# Altium schematic sheet Analog_output.SchDoc
size A; SheetNumber: 6; SheetTotal: 6
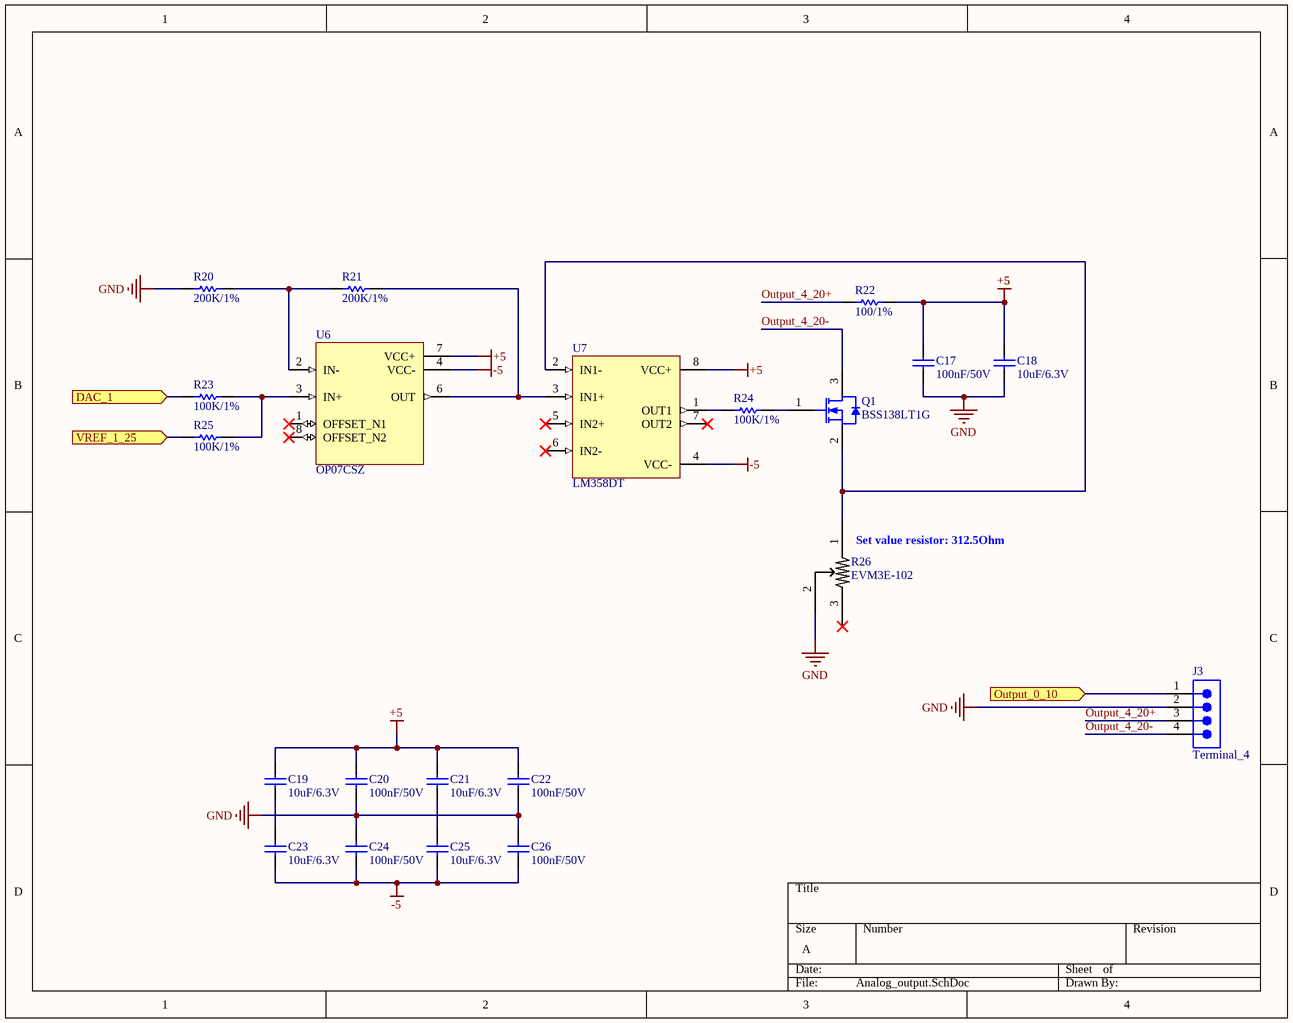
[diagram p0: Analog_output.SchDoc]

## Parts
C17  100nF/50V  [CAP_0805]
C18  10uF/6.3V  [CAP_0805]
C19  10uF/6.3V  [CAP_0805]
C20  100nF/50V  [CAP_0805]
C21  10uF/6.3V  [CAP_0805]
C22  100nF/50V  [CAP_0805]
C23  10uF/6.3V  [CAP_0805]
C24  100nF/50V  [CAP_0805]
C25  10uF/6.3V  [CAP_0805]
C26  100nF/50V  [CAP_0805]
J3  Terminal_4  [TBL_4_3_81]
Q1  BSS138LT1G  [SQ2398ES-SOT23]
R20  200K/1%  [RES_0805]
R21  200K/1%  [RES_0805]
R22  100/1%  [RES_0805]
R23  100K/1%  [RES_0805]
R24  100K/1%  [RES_0805]
R25  100K/1%  [RES_0805]
R26  EVM3E-102  [EVM3E]
U6  OP07CSZ  [SOIC127P600X175-8N]
U7  LM358DT  [SOIC127P600X175-8N]

## Ports
DAC_1 (in), Output_0_10 (in), VREF_1_25 (in)

## Nets
+5: C17.2 C18.2 C19.2 C20.2 C21.2 C22.2 R22.2 U6.7(VCC+) U7.8(VCC+)
-5: C23.1 C24.1 C25.1 C26.1 U6.4(VCC-) U7.4(VCC-)
GND: C17.1 C18.1 C20.1 C22.1 C24.2 C26.2 J3.2 R20.1 R26.2
DAC_1: R23.1 ; port DAC_1
Output_0_10: J3.1 ; port Output_0_10
Output_4_20+: J3.3 R22.1
Output_4_20-: J3.4 Q1.3(D)
VREF_1_25: R25.1 ; port VREF_1_25
NetC19_1: C19.1 C23.2
NetC21_1: C21.1 C25.2
NetQ1_1: Q1.1(G) R24.2
NetQ1_2: Q1.2(S) R26.1 U7.2(IN1-)
NetR20_2: R20.2 R21.1 U6.2(IN-)
NetR21_2: R21.2 U6.6(OUT) U7.3(IN1+)
NetR23_2: R23.2 R25.2 U6.3(IN+)
NetR24_1: R24.1 U7.1(OUT1)

Not connected (* = marked no-connect by the designer): R26 3*; U6 1(OFFSET_N1)* 8(OFFSET_N2)*; U7 5(IN2+)* 6(IN2-)* 7(OUT2)*

## Notes on the sheet
- (near R26) Set value resistor: 312.5Ohm

## Library data of the parts
C17-C26 = Capacitor: Size: 0805
  C17 C20 C22 C24 C26: URL: https://www.thegioiic.com/tu-gom-0805-100nf-0-1uf-50v; Value: 100nF/50V
  C18 C19 C21 C23 C25: URL: https://www.thegioiic.com/tu-gom-0805-10uf-6-3v; Value: 10uF/6.3V
J3 = Terminal_4: Value: 20A, 300V
Q1 = BSS138LT1G: BSS138LT1G, MOSFET, N ,50V, 200mA ,SOT-23; Size: SOT-23; URL: https://www.thegioiic.com/bss138lt1g-mosfet-kenh-n-50v-200ma-sot-23?gidzl=ejQjBwD9gJIgoweegb-XEgd0foIs3Qmxv9EgAUq7gMEvcFujlbAkFktE-2NgLAvjwy6k8Z0nh38heKYfCm; Value: BSS138LT1G
R20-R25 = Resistor: Size: 0805
  R20 R21: URL: https://www.thegioiic.com/dien-tro-200-kohm-0805-1-; Value: 200K/1%
  R22: URL: https://www.thegioiic.com/dien-tro-100-kohm-0805-1-; Value: 100/1%
  R23-R25: URL: https://www.thegioiic.com/dien-tro-100-kohm-0805-1-; Value: 100K/1%
R26 = EVM3E-102: 1KOhm, 0.15W,  ±20%, EVM3E; URL: https://www.thegioiic.com/evm3e-102-bien-tro-1-kohm-nut-ao-smd-0-15w; Value: EVM3E-102; Size: EVM3E
U6 = OP07CSZ: Low-Offset Voltage Operational Amplifier; Size: 8-SOIC; URL: https://www.thegioiic.com/op07csz-ic-opamp-general-purpose-amplifier-1-circuit-600khz-8-soic; Value: OP07CSZ
U7 = LM358DT: General Purpose Amplifier 2 Circuit 8-SO; Size: 8-SOIC; URL: https://www.thegioiic.com/lm358dt-ic-opamp-general-purpose-amplifier-2-circuit-1-1mhz-8-soic; Value: LM358DT